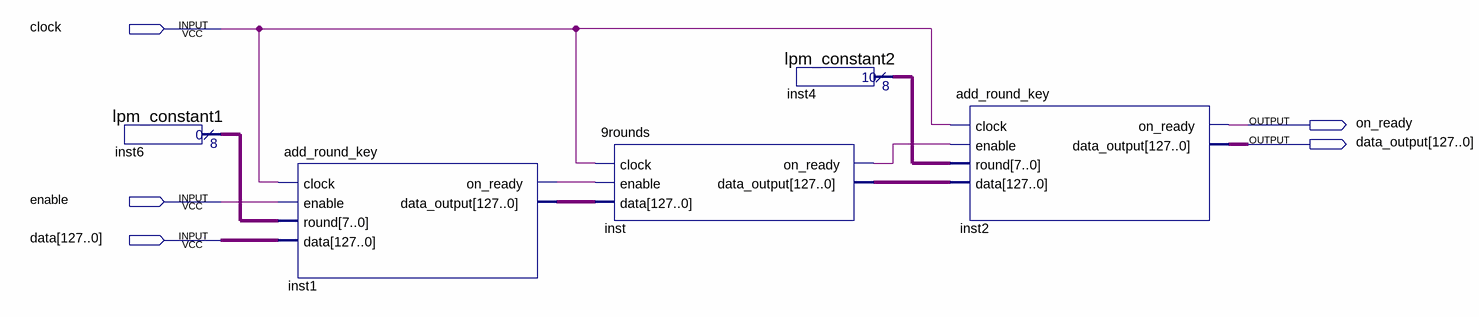
[diagram p0: schematic sheet]
// Quartus schematic aes_encrypt.bdf as structural Verilog: 5 symbols, 5 pins
module aes_encrypt (
  input  clock,
  input  enable,
  input  [127:0] data,
  output on_ready,
  output [127:0] data_output
);

  wire inst1_on_ready, inst_on_ready;
  wire [7:0] inst4_result, inst6_result;
  wire [127:0] inst1_data_output, inst_data_output;

  lpm_constant1 inst6 (.result(inst6_result));
  add_round_key inst1 (
    .clock(clock), .enable(enable), .round(inst6_result), .data(data), .on_ready(inst1_on_ready),
    .data_output(inst1_data_output));
  \9rounds  inst (
    .clock(clock), .enable(inst1_on_ready), .data(inst1_data_output), .on_ready(inst_on_ready),
    .data_output(inst_data_output));
  lpm_constant2 inst4 (.result(inst4_result));
  add_round_key inst2 (
    .clock(clock), .enable(inst_on_ready), .round(inst4_result), .data(inst_data_output),
    .on_ready(on_ready), .data_output(data_output));
endmodule
